# Altium schematic sheet ParallelVias.SchDoc
size Letter
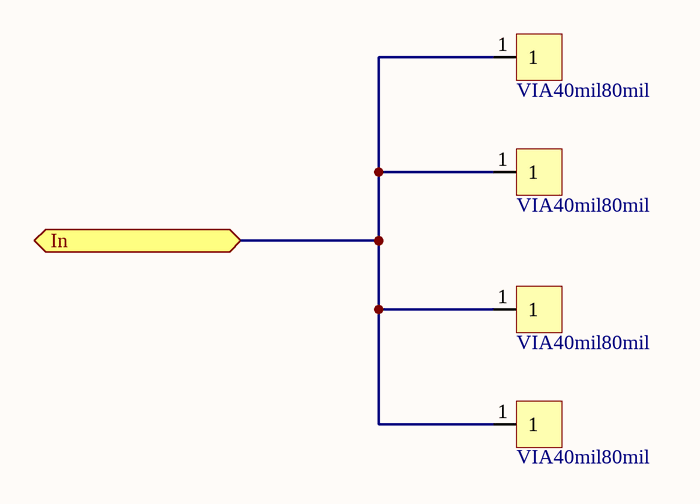
[diagram p0: ParallelVias.SchDoc]

## Parts
V1  VIA40mil80mil  [VIA40mil80mil]
V2  VIA40mil80mil  [VIA40mil80mil]
V3  VIA40mil80mil  [VIA40mil80mil]
V4  VIA40mil80mil  [VIA40mil80mil]

## Ports
In

## Nets
In: V1.1 V2.1 V3.1 V4.1 ; port In